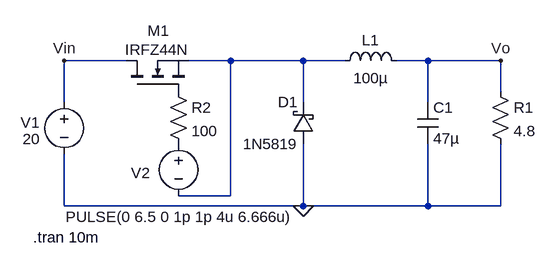
[diagram p0: schematic ANALISIS_PERDIDAS_1.asc]
ANALISIS_PERDIDAS_1.asc, the LTspice schematic file:
Version 4
SHEET 1 880 680
WIRE -80 16 -176 16
WIRE 80 16 16 16
WIRE 192 16 80 16
WIRE 256 16 192 16
WIRE 384 16 336 16
WIRE 496 16 384 16
WIRE 496 64 496 16
WIRE -176 80 -176 16
WIRE 192 80 192 16
WIRE 384 80 384 16
WIRE 80 224 80 16
WIRE 80 224 0 224
WIRE -176 240 -176 160
WIRE 192 240 192 144
WIRE 192 240 -176 240
WIRE 384 240 384 144
WIRE 384 240 192 240
WIRE 496 240 496 144
WIRE 496 240 384 240
FLAG 192 240 0
FLAG 496 16 Vo
FLAG -176 16 Vin
SYMBOL voltage -176 64 R0
WINDOW 123 0 0 Left 0
WINDOW 39 0 0 Left 0
WINDOW 0 -67 47 Left 2
WINDOW 3 -64 73 Left 2
SYMATTR InstName V1
SYMATTR Value 20
SYMBOL nmos -80 64 R270
WINDOW 0 94 32 VRight 2
WINDOW 3 65 -2 VRight 2
SYMATTR InstName M1
SYMATTR Value IRFZ44N
SYMBOL ind 240 32 R270
WINDOW 0 32 56 VTop 2
WINDOW 3 5 56 VBottom 2
SYMATTR InstName L1
SYMATTR Value 100µ
SYMBOL schottky 208 144 R180
WINDOW 0 24 64 Left 2
WINDOW 3 24 0 Left 2
SYMATTR InstName D1
SYMATTR Value 1N5819
SYMATTR Description Diode
SYMATTR Type diode
SYMBOL cap 368 80 R0
SYMATTR InstName C1
SYMATTR Value 47µ
SYMBOL res 480 48 R0
SYMATTR InstName R1
SYMATTR Value 4.8
SYMBOL voltage 0 128 R0
WINDOW 3 -174 129 Left 2
WINDOW 123 0 0 Left 0
WINDOW 39 0 0 Left 0
WINDOW 0 -73 61 Left 2
SYMATTR Value PULSE(0 6.5 0 1p 1p 4u 6.666u)
SYMATTR InstName V2
SYMBOL res -16 48 R0
SYMATTR InstName R2
SYMATTR Value 100
TEXT -224 288 Left 2 !.tran 10m

The netlist it stands for:
* ANALISIS_PERDIDAS_1.asc
V1 Vin 0 20
M1 Vin P001 N001 N001 IRFZ44N
L1 N001 Vo 100µ
D1 0 N001 1N5819
C1 Vo 0 47µ
R1 Vo 0 4.8
V2 P002 N001 PULSE(0 6.5 0 1p 1p 4u 6.666u)
R2 P001 P002 100
.model D D
.lib standard.dio
.model NMOS NMOS
.model PMOS PMOS
.lib standard.mos
.tran 10m
.backanno
.end